# Altium schematic sheet WCH_TOUCH_Kit_EX001.SchDoc
size A4
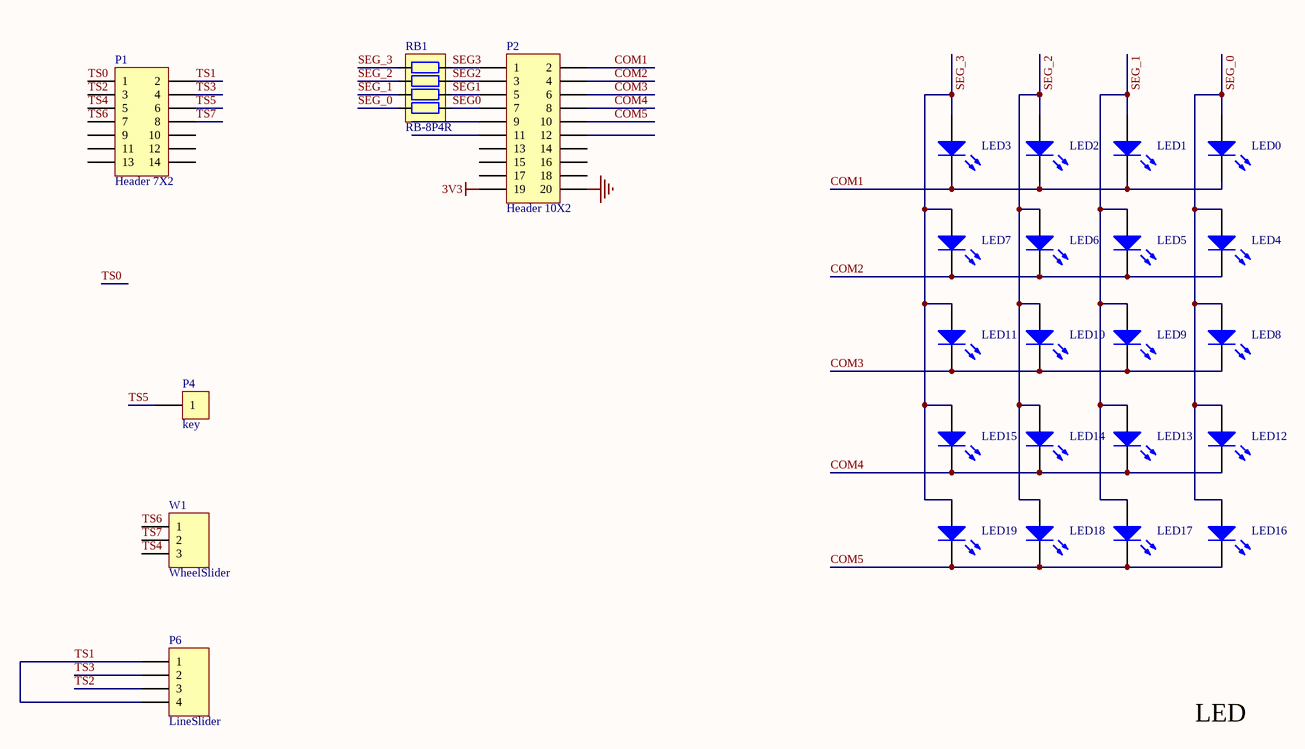
[diagram p0: WCH_TOUCH_Kit_EX001.SchDoc]

## Parts
LED0  (no value)  [LED0805-RD_EH]
LED1  (no value)  [LED0805-RD_EH]
LED2  (no value)  [LED0805-RD_EH]
LED3  (no value)  [LED0805-RD_EH]
LED4  (no value)  [LED0805-RD_EH]
LED5  (no value)  [LED0805-RD_EH]
LED6  (no value)  [LED0805-RD_EH]
LED7  (no value)  [LED0805-RD_EH]
LED8  (no value)  [LED0805-RD_EH]
LED9  (no value)  [LED0805-RD_EH]
LED10  (no value)  [LED0805-RD_EH]
LED11  (no value)  [LED0805-RD_EH]
LED12  (no value)  [LED0805-RD_EH]
LED13  (no value)  [LED0805-RD_EH]
LED14  (no value)  [LED0805-RD_EH]
LED15  (no value)  [LED0805-RD_EH]
LED16  (no value)  [LED0805-RD_EH]
LED17  (no value)  [LED0805-RD_EH]
LED18  (no value)  [LED0805-RD_EH]
LED19  (no value)  [LED0805-RD_EH]
P1  Header 7X2  [HDR-TH_14P-P2.54-H-F-R2-C10-W8.5]
P2  Header 10X2  [HDR-TH_20P-P2.54-H-F-R2-C10-W8.5]
P4  key  [key]
P6  LineSlider  [Slider_4_46X8.5]
RB1  RB-8P4R  [RCA-8P4R-0603]
W1  WheelSlider  [滑轮10-18-3]

## Nets
3V3: P2.19
GND: P2.20
COM1: LED0.2(K) LED1.2(K) LED2.2(K) LED3.2(K) P2.2
COM2: LED4.2(K) LED5.2(K) LED6.2(K) LED7.2(K) P2.4
COM3: LED8.2(K) LED9.2(K) LED10.2(K) LED11.2(K) P2.6
COM4: LED12.2(K) LED13.2(K) LED14.2(K) LED15.2(K) P2.8
COM5: LED16.2(K) LED17.2(K) LED18.2(K) LED19.2(K) P2.10
SEG0: P2.7 RB1.4
SEG1: P2.5 RB1.3
SEG2: P2.3 RB1.2
SEG3: P2.1 RB1.1
SEG_0: LED0.1(A) LED4.1(A) LED8.1(A) LED12.1(A) LED16.1(A) RB1.5
SEG_1: LED1.1(A) LED5.1(A) LED9.1(A) LED13.1(A) LED17.1(A) RB1.6
SEG_2: LED2.1(A) LED6.1(A) LED10.1(A) LED14.1(A) LED18.1(A) RB1.7
SEG_3: LED3.1(A) LED7.1(A) LED11.1(A) LED15.1(A) LED19.1(A) RB1.8
TS0: P1.1
TS1: P1.2 P6.1 P6.4
TS2: P1.3 P6.3
TS3: P1.4 P6.2
TS4: P1.5 W1.3
TS5: P1.6 P4.1
TS6: P1.7 W1.1
TS7: P1.8 W1.2

Not connected (* = marked no-connect by the designer): P1 9 10 11 12 13 14; P2 9 11 12 13 14 15 16 17 18

## Notes on the sheet
- LED

## Library data of the parts
LED0-LED19 = LED3: Typical BLUE SiC LED; Published: 8-Jun-2000; LatestRevisionDate: 17-Dec-2003; LatestRevisionNote: PCB Footprint replaced.; DatasheetVersion: 16-Apr-2002; PackageVersion: 16-Apr-2002; PackageReference: 3.5X2.8X1.9; Publisher: Altium Limited; PackageDescription: SM LED; 2 C-Bend Leads; Body 3.5 x 2.8 x 1.9 mm, inc leads (LxWxH typ)
P1 = Header 7X2: Header, 7-Pin, Dual row; LatestRevisionDate: 17-Jul-2002; LatestRevisionNote: Re-released for DXP Platform.; Publisher: Altium Limited
P2 = Header 10X2: Header, 10-Pin, Dual row; LatestRevisionDate: 17-Jul-2002; LatestRevisionNote: Re-released for DXP Platform.; Publisher: Altium Limited
P4 = HEADER 1: Header, 1-Pin
P6 = HEADER 4: Header, 4-Pin
RB1 = RB-8P4R: 贴片网络排阻
W1 = HEADER 3: Header, 3-Pin